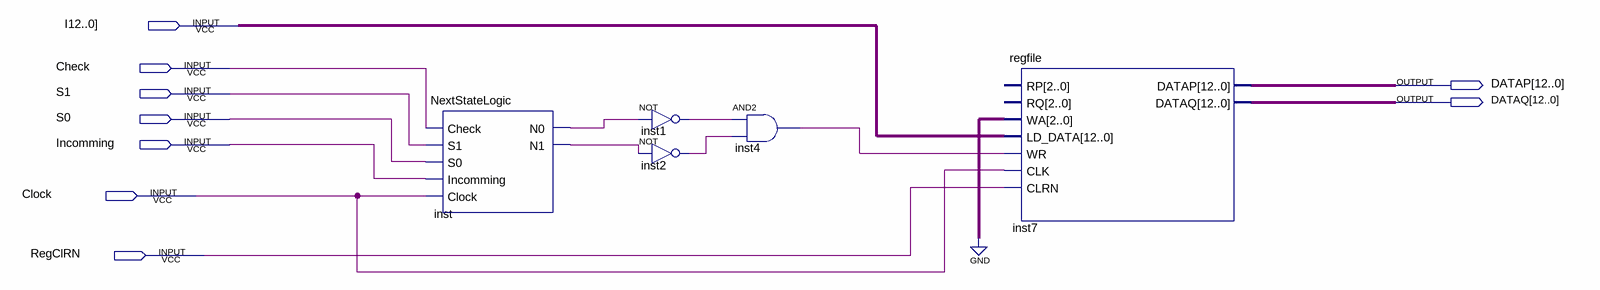
[diagram p0: schematic sheet]
// Quartus schematic Reaction-Time-Game.bdf as structural Verilog: 5 symbols, 9 pins
module \Reaction-Time-Game  (
  input  \I12..0] ,
  input  Check,
  input  S1,
  input  S0,
  input  Incomming,
  input  Clock,
  input  RegClRN,
  output [12:0] DATAP,
  output [12:0] DATAQ
);

  wire inst1_out, inst2_out, inst4_out, inst_n0, inst_n1;
  wire [12:0] undriven;

  NextStateLogic inst (
    .Check(Check), .S1(S1), .S0(S0), .Incomming(Incomming), .Clock(Clock), .N0(inst_n0), .N1(inst_n1));
  not inst1 (inst1_out, inst_n0);
  not inst2 (inst2_out, inst_n1);
  and inst4 (inst4_out, inst1_out, inst2_out);
  regfile inst7 (
    .WA(3'b000), .LD_DATA(undriven), .WR(inst4_out), .CLK(Clock), .CLRN(RegClRN), .DATAP(DATAP), .DATAQ(DATAQ));  // open: RP, RQ
endmodule
